# Altium schematic sheet SAME51_PINOUT.SchDoc
size C; SheetNumber: 3; SheetTotal: 5
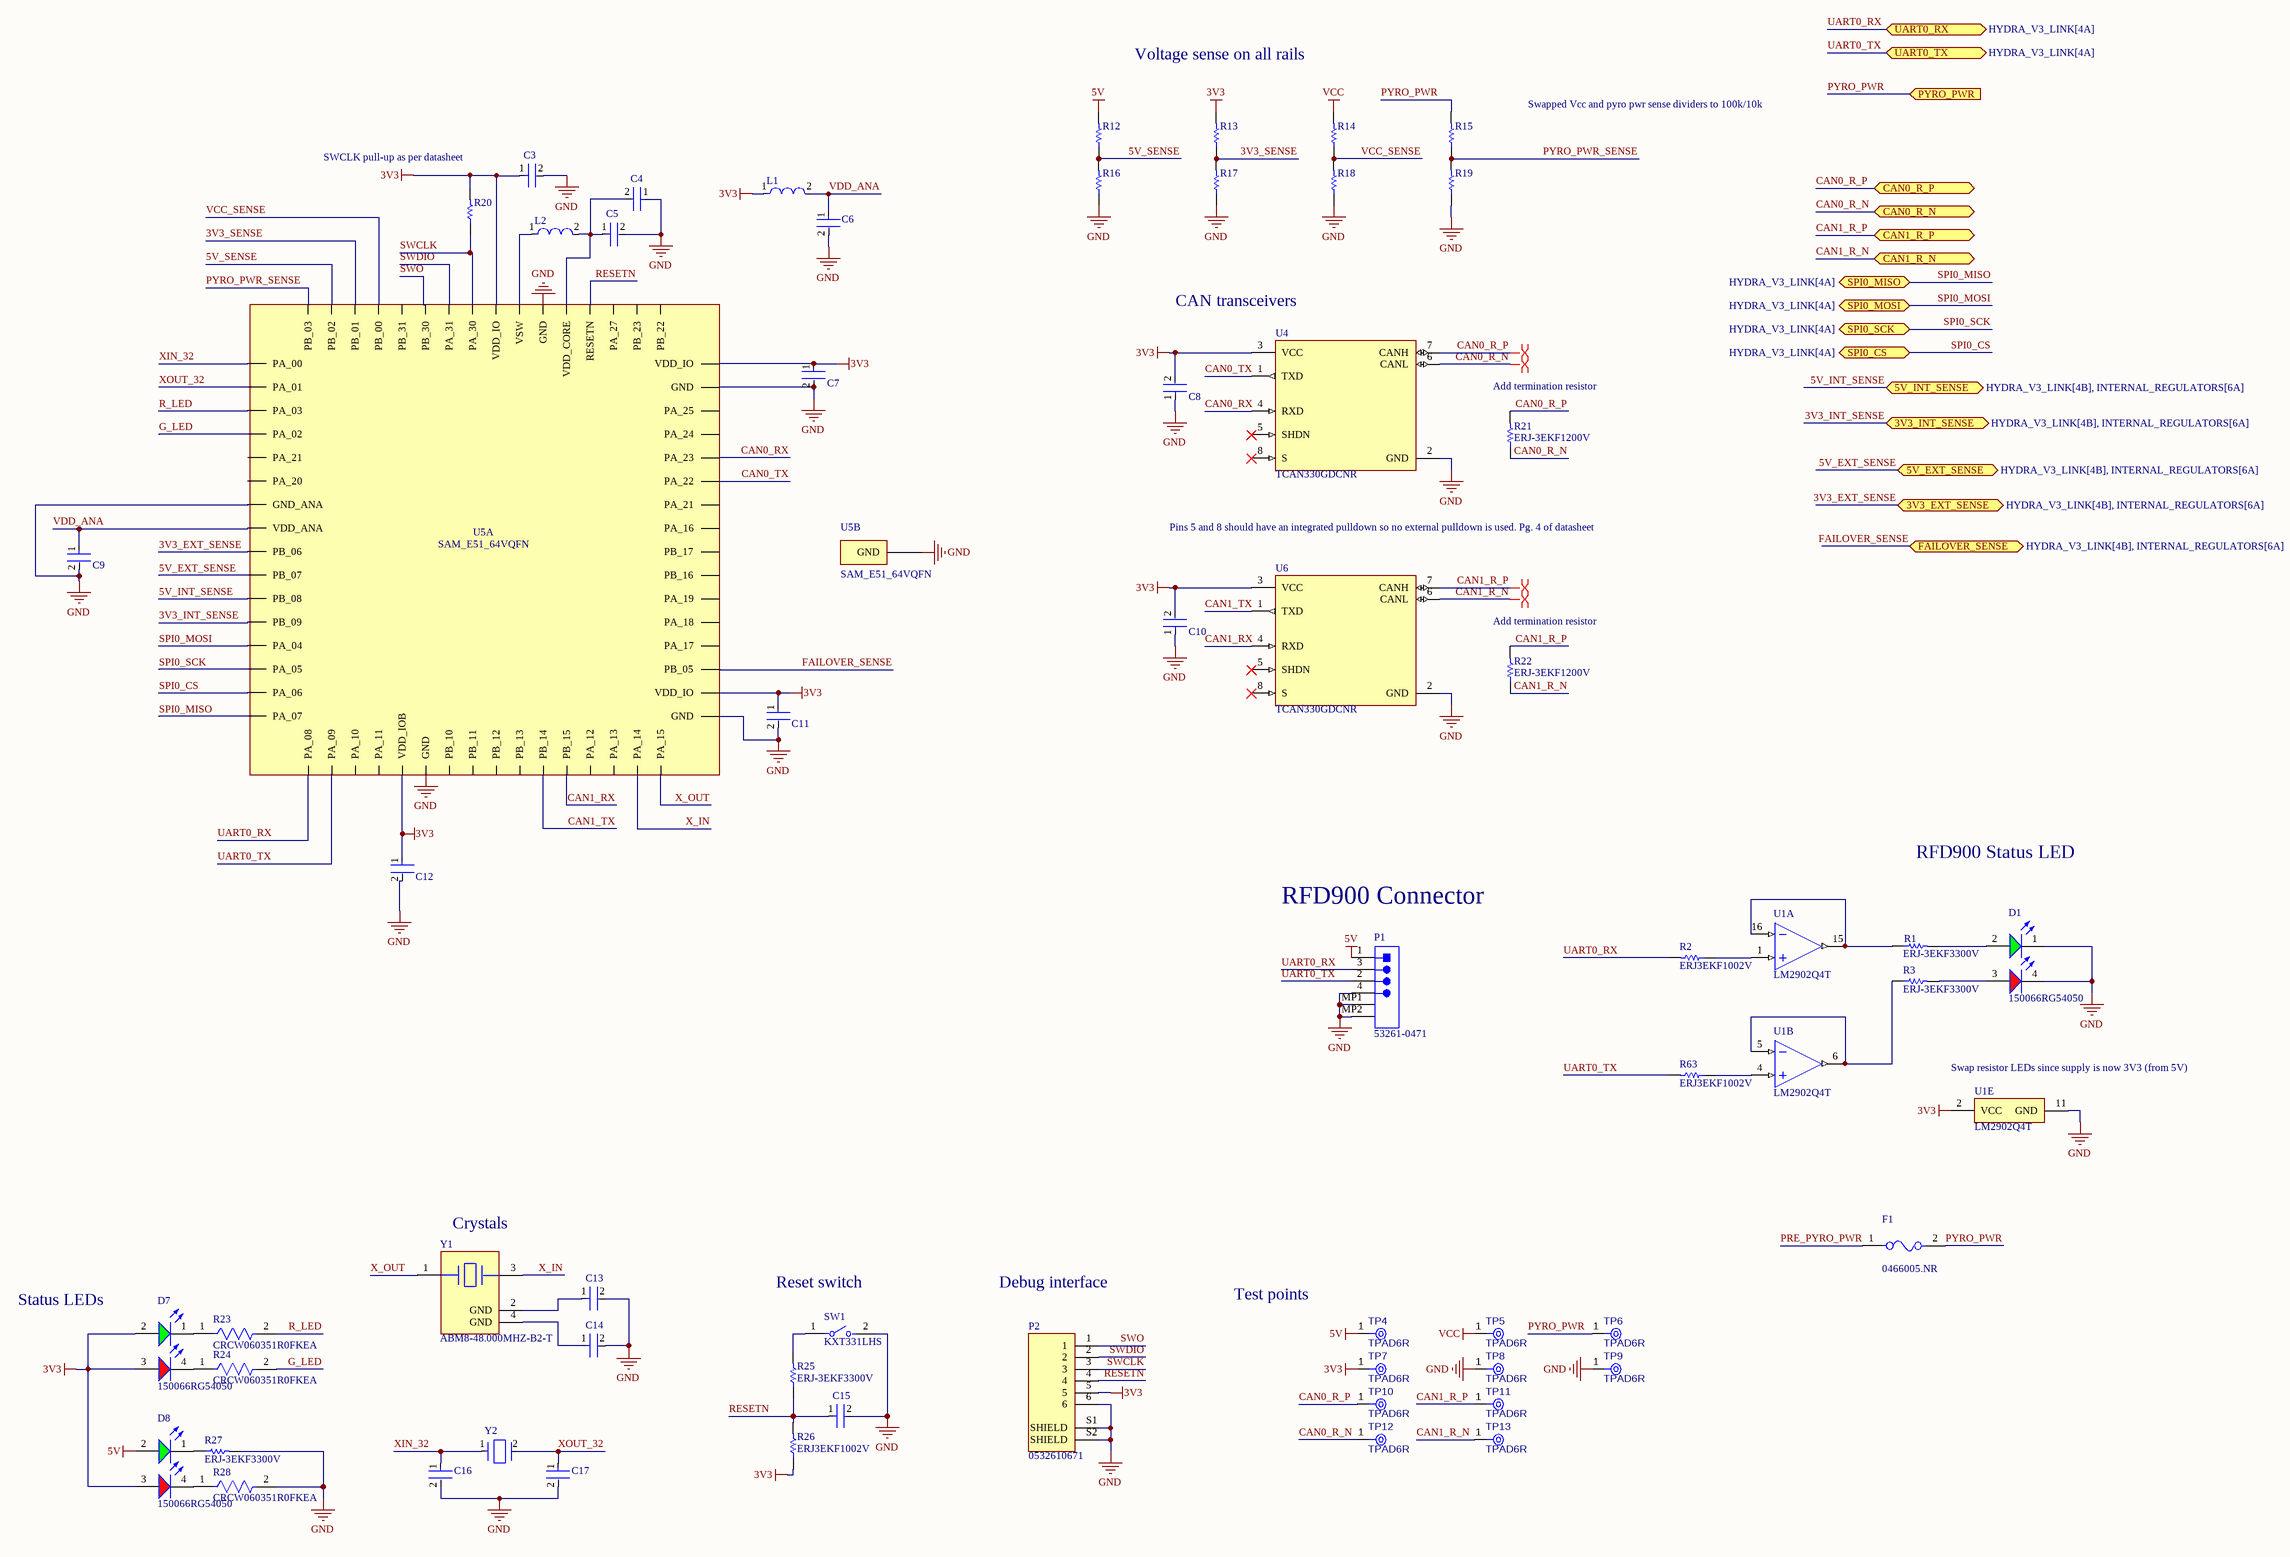
[diagram p0: SAME51_PINOUT.SchDoc]

## Parts
C3  C0402C104K8PACTU  [FP-C0402-BB-MFG]  (value not drawn)
C4  GRM155R60J475ME47D  [FP-GRM155-0_1-IPC_B]  (value not drawn)
C5  C0402C104K8PACTU  [FP-C0402-BB-MFG]  (value not drawn)
C6  C0805C106K8PACTU  [FP-C0805C-DG-MFG]  (value not drawn)
C7  C0402C104K8PACTU  [FP-C0402-BB-MFG]  (value not drawn)
C8  C0402C104K8PACTU  [FP-C0402-BB-MFG]  (value not drawn)
C9  C0402C104K8PACTU  [FP-C0402-BB-MFG]  (value not drawn)
C10  C0402C104K8PACTU  [FP-C0402-BB-MFG]  (value not drawn)
C11  C0402C104K8PACTU  [FP-C0402-BB-MFG]  (value not drawn)
C12  C0402C104K8PACTU  [FP-C0402-BB-MFG]  (value not drawn)
C13  08051A6R8CAT2A  [FP-0805-L_2_01_0_2-W_1_25-MFG]  (value not drawn)
C14  08051A6R8CAT2A  [FP-0805-L_2_01_0_2-W_1_25-MFG]  (value not drawn)
C15  C0402C104K8PACTU  [FP-C0402-BB-MFG]  (value not drawn)
C16  C0805C180J5GACTU  [FP-C0805C-DN-MFG]  (value not drawn)
C17  C0805C180J5GACTU  [FP-C0805C-DN-MFG]  (value not drawn)
D1  150066RG54050  [WL-SBCD_0606]
D7  150066RG54050  [WL-SBCD_0606]
D8  150066RG54050  [WL-SBCD_0606]
F1  0466005.NR  [FP-0466-MFG]
L1  NR6028T100M  [FP-NR6028-MFG]  (value not drawn)
L2  NR6028T100M  [FP-NR6028-MFG]  (value not drawn)
P1  53261-0471  [MOLEX-53261-0471_V]
P2  0532610671  [0532610671-Footprint-1]
R1  ERJ-3EKF3300V  [RESC1608X55X30LL15T15]
R2  ERJ3EKF1002V  [RESC1609X55X30LL15T15]
R3  ERJ-3EKF3300V  [RESC1608X55X30LL15T15]
R12  ERJ3EKF1002V  [RESC1609X55X30LL15T15]  (value not drawn)
R13  ERJ3EKF1002V  [RESC1609X55X30LL15T15]  (value not drawn)
R14  ERJ-3EKF1003V  [RESC1608X55X30ML15T15]  (value not drawn)
R15  ERJ-3EKF1003V  [RESC1608X55X30ML15T15]  (value not drawn)
R16  ERJ3EKF1002V  [RESC1609X55X30LL15T15]  (value not drawn)
R17  ERJ3EKF1002V  [RESC1609X55X30LL15T15]  (value not drawn)
R18  ERJ3EKF1002V  [RESC1609X55X30LL15T15]  (value not drawn)
R19  ERJ3EKF1002V  [RESC1609X55X30LL15T15]  (value not drawn)
R20  ERJ3EKF1002V  [RESC1609X55X30LL15T15]  (value not drawn)
R21  ERJ-3EKF1200V  [RESC1609X55X30ML15T15]
R22  ERJ-3EKF1200V  [RESC1609X55X30ML15T15]
R23  CRCW060351R0FKEA  [FP-CRCW0603-e3-MFG]
R24  CRCW060351R0FKEA  [FP-CRCW0603-e3-MFG]
R25  ERJ-3EKF3300V  [RESC1608X55X30LL15T15]
R26  ERJ3EKF1002V  [RESC1609X55X30LL15T15]
R27  ERJ-3EKF3300V  [RESC1608X55X30LL15T15]
R28  CRCW060351R0FKEA  [FP-CRCW0603-e3-MFG]
R63  ERJ3EKF1002V  [RESC1609X55X30LL15T15]
SW1  KXT331LHS  [FP-KXT331LHS-MFG]
TP4  TPAD6R  [TP06R]  (no BOM)
TP5  TPAD6R  [TP06R]  (no BOM)
TP6  TPAD6R  [TP06R]  (no BOM)
TP7  TPAD6R  [TP06R]  (no BOM)
TP8  TPAD6R  [TP06R]  (no BOM)
TP9  TPAD6R  [TP06R]  (no BOM)
TP10  TPAD6R  [TP06R]  (no BOM)
TP11  TPAD6R  [TP06R]  (no BOM)
TP12  TPAD6R  [TP06R]  (no BOM)
TP13  TPAD6R  [TP06R]  (no BOM)
U1  LM2902Q4T  [LM2902Q4T-Footprint-1]  (parts A,B,E of 5)
U4  TCAN330GDCNR  [FP-DCN0008A-MFG]
U5  SAM_E51_64VQFN  [SAM_E51_64VQFN-Footprint-1]  (parts A,B of 2)
U6  TCAN330GDCNR  [FP-DCN0008A-MFG]
Y1  ABM8-48.000MHZ-B2-T  [FP-ABM8-MFG]
Y2  ECS-.327-12.5-1210-TR  [FP-ECX-1210-MFG]  (value not drawn)

## Ports
3V3_EXT_SENSE (bidir, see HYDRA_V3_LINK[4B], INTERNAL_REGULATORS[6A]), 3V3_INT_SENSE (bidir, see HYDRA_V3_LINK[4B], INTERNAL_REGULATORS[6A]), 5V_EXT_SENSE (bidir, see HYDRA_V3_LINK[4B], INTERNAL_REGULATORS[6A]), 5V_INT_SENSE (bidir, see HYDRA_V3_LINK[4B], INTERNAL_REGULATORS[6A]), CAN0_R_N (bidir, see HYDRA_V3_LINK[4B]), CAN0_R_P (bidir, see HYDRA_V3_LINK[4B]), CAN1_R_N (bidir, see HYDRA_V3_LINK[4B]), CAN1_R_P (bidir, see HYDRA_V3_LINK[4B]), FAILOVER_SENSE (bidir, see HYDRA_V3_LINK[4B], INTERNAL_REGULATORS[6A]), PYRO_PWR (in, see HYDRA_V3_LINK[4A], INTERNAL_REGULATORS[1C]), SPI0_CS (bidir, see HYDRA_V3_LINK[4A]), SPI0_MISO (bidir, see HYDRA_V3_LINK[4A]), SPI0_MOSI (bidir, see HYDRA_V3_LINK[4A]), SPI0_SCK (bidir, see HYDRA_V3_LINK[4A]), UART0_RX (bidir, see HYDRA_V3_LINK[4A]), UART0_TX (bidir, see HYDRA_V3_LINK[4A])

## Nets
3V3: C3.1 C7.1 C8.2 C10.2 C11.1 C12.1 D7.2(A) D7.3(A) D8.3(A) L1.1 P2.5 R13.2 R20.2 R26.1 TP7.1(TP) U1.2(VCC) U4.3(VCC) U5.21(VDD_IOB) U5.34(VDD_IO) U5.48(VDD_IO) U5.56(VDD_IO) U6.3(VCC)
5V: D8.2(A) P1.1 R12.2 TP4.1(TP)
GND: C3.2 C4.1 C5.2 C6.2 C7.2 C8.1 C9.2 C10.1 C11.2 C12.2 C13.2 C14.2 C15.2 C16.2 C17.2 D1.1(K) D1.4(K) P1.4 P1.MP1 P1.MP2 P2.6 P2.S1(SHIELD) P2.S2(SHIELD) R16.1 R17.1 R18.1 R19.1 R27.2 R28.2 SW1.2 TP8.1(TP) TP9.1(TP) U1.11(GND) U4.2(GND) U5.7(GND_ANA) U5.22(GND) U5.33(GND) U5.47(GND) U5.54(GND) U5.65(GND) U6.2(GND)
VCC: R14.2 TP5.1(TP)
3V3_EXT_SENSE: U5.9(PB_06) ; port 3V3_EXT_SENSE
3V3_INT_SENSE: U5.12(PB_09) ; port 3V3_INT_SENSE
3V3_SENSE: R13.1 R17.2 U5.62(PB_01)
5V_EXT_SENSE: U5.10(PB_07) ; port 5V_EXT_SENSE
5V_INT_SENSE: U5.11(PB_08) ; port 5V_INT_SENSE
5V_SENSE: R12.1 R16.2 U5.63(PB_02)
CAN0_R_N: R21.1 TP12.1(TP) U4.6(CANL) ; port CAN0_R_N
CAN0_R_P: R21.2 TP10.1(TP) U4.7(CANH) ; port CAN0_R_P
CAN0_RX: U4.4(RXD) U5.44(PA_23)
CAN0_TX: U4.1(TXD) U5.43(PA_22)
CAN1_R_N: R22.1 TP13.1(TP) U6.6(CANL) ; port CAN1_R_N
CAN1_R_P: R22.2 TP11.1(TP) U6.7(CANH) ; port CAN1_R_P
CAN1_RX: U5.28(PB_15) U6.4(RXD)
CAN1_TX: U5.27(PB_14) U6.1(TXD)
FAILOVER_SENSE: U5.6(PB_05) ; port FAILOVER_SENSE
G_LED: R24.2 U5.3(PA_02)
PRE_PYRO_PWR: F1.1
PYRO_PWR: F1.2 R15.2 TP6.1(TP) ; port PYRO_PWR
PYRO_PWR_SENSE: R15.1 R19.2 U5.64(PB_03)
R_LED: R23.2 U5.4(PA_03)
RESETN: C15.1 P2.4 R25.1 R26.2 U5.52(RESETN)
SPI0_CS: U5.15(PA_06) ; port SPI0_CS
SPI0_MISO: U5.16(PA_07) ; port SPI0_MISO
SPI0_MOSI: U5.13(PA_04) ; port SPI0_MOSI
SPI0_SCK: U5.14(PA_05) ; port SPI0_SCK
SWCLK: P2.3 R20.1 U5.57(PA_30)
SWDIO: P2.2 U5.58(PA_31)
SWO: P2.1 U5.59(PB_30)
UART0_RX: P1.3 R2.2 U5.17(PA_08) ; port UART0_RX
UART0_TX: P1.2 R63.2 U5.18(PA_09) ; port UART0_TX
VCC_SENSE: R14.1 R18.2 U5.61(PB_00)
VDD_ANA: C6.1 C9.1 L1.2 U5.8(VDD_ANA)
X_IN: U5.31(PA_14) Y1.3
X_OUT: U5.32(PA_15) Y1.1
XIN_32: C16.1 U5.1(PA_00) Y2.1(In/Out)
XOUT_32: C17.1 U5.2(PA_01) Y2.2(Out/In)
NetC4_2: C4.2 C5.1 L2.2 U5.53(VDD_CORE)
NetC13_1: C13.1 Y1.2(GND)
NetC14_1: C14.1 Y1.4(GND)
NetD1_2: D1.2(A) R1.2
NetD1_3: D1.3(A) R3.2
NetD7_1: D7.1(K) R23.1
NetD7_4: D7.4(K) R24.1
NetD8_1: D8.1(K) R27.1
NetD8_4: D8.4(K) R28.1
NetL2_1: L2.1 U5.55(VSW)
NetR1_1: R1.1 U1.15(1OUT) U1.16(1IN-)
NetR2_1: R2.1 U1.1(1IN+)
NetR3_1: R3.1 U1.5(2IN-) U1.6(2OUT)
NetR25_2: R25.2 SW1.1
NetR63_1: R63.1 U1.4(2IN+)

Not connected (* = marked no-connect by the designer): U4 5(SHDN)* 8(S)*; U5 19(PA_10) 20(PA_11) 23(PB_10) 24(PB_11) 25(PB_12) 26(PB_13) 29(PA_12) 30(PA_13) 35(PA_16) 36(PA_17) 37(PA_18) 38(PA_19) 39(PB_16) 40(PB_17) 41(PA_20) 42(PA_21) 45(PA_24) 46(PA_25) 49(PB_22) 50(PB_23) 51(PA_27) 60(PB_31); U6 5(SHDN)* 8(S)*

## Layout directives
differential pair: CAN0_R_N, CAN0_R_P, CAN1_R_N, CAN1_R_P

## Notes on the sheet
- Voltage sense on all rails
- Swapped Vcc and pyro pwr sense dividers to 100k/10k
- SWCLK pull-up as per datasheet
- (near U4) CAN transceivers
- (near R21) Add termination resistor
- Pins 5 and 8 should have an integrated pulldown so no external pulldown is used. Pg. 4 of datasheet
- (near R22) Add termination resistor
- RFD900 Status LED
- RFD900 Connector
- (near U1) Swap resistor LEDs since supply is now 3V3 (from 5V)
- (near Y1) Crystals
- (near SW1) Reset switch
- Debug interface
- Status LEDs
- Test points

## Library data of the parts
C3 C5 C7-C12 C15 = CMP-2008-02046-2: CAP CER 0.1UF 10V X5R 0402; Manufacturer: Kemet; Material: Ceramic; Capacitance: 0.10 μF; Temperature Coefficient: 15%; Tolerance: 0.1; Value: 0.10 μF; Package: C0402-BB; Temperature: -55°C to +125°C; ComponentLink2Description: Datasheet; Temperature Characteristic: X5R; Device Class L1: Passive Components; Height: 0.55mm; Lead Free: Yes; ComponentLink2URL: https://content.kemet.com/datasheets/KEM_C1002_X7R_SMD.pdf; Device Class L2: Capacitors; Temperature Range Low: -55°C; Temperature Range High: +125°C; RoHS: TRUE; Octopart: https://octopart.com/c0402c104k8pactu-kemet-140039; Automotive: No; Mouser Description: Capacitor 100 nF 10 VDC 0402; Category: Cap; Voltage Rating: 10 V; Digikey Description: CAP CER 0.1UF 10V X5R 0402; Ipc Land Pattern Name: CAPC10050X50; Device Class L3: Ceramic Capacitors; Manufacturer Part Number: C0402C104K8PACTU
C4 = CMP-2008-04549-2: Chip Multilayer Ceramic Capacitors for General Purpose, 0402, 4.7uF, X5R, 15%, 20%, 6.3V; Height: 0.5mm; Weight: 0.000212oz; Length: 1mm; Case Code (Metric): 1005; Packaging: Tape and Reel; Termination: SMD/SMT; Dielectric: X5R; Depth: 0.5mm; Case Code (Imperial): 0402; Min Operating Temperature: -55°C; Case/Package: 0402; Voltage: 6.3V; Width: 0.02inch; Capacitance: 4.7uF; Lead Free: Lead Free; Thickness: 0.022inch; Contact Plating: Tin; REACH SVHC: No SVHC; Package Quantity: 10000; Tolerance: 20%; Voltage Rating (DC): 6.3V; Voltage Rating: 6.3V; Mount: Surface Mount; Max Operating Temperature: 85°C
C6 = CMP-2007-03243-2: CAP CER 10UF 10V X5R 0805; Manufacturer: Kemet; 3DS Part Number: 220-00001; Tolerance: 10%; Temperature Coefficient: 15%; Material: Ceramic; Device Class L2: Capacitors; Device Class L1: Passive Components; ComponentLink2URL: https://content.kemet.com/datasheets/KEM_C1006_X5R_SMD.pdf; Height: 1.4mm; Lead Free: Yes; Manufacturer Part Number: C0805C106K8PACTU; Digikey Description: CAP CER 10UF 10V X5R 0805; Octopart: https://octopart.com/c0805c106k8pactu-kemet-98697; Capacitance: 10uF; Value: 10uF; Temperature Range Low: -55°C; Temperature: -55°C to +85°C; Automotive: No; Mouser Description: CAP CER 10UF 10V X5R 0805; Ipc Land Pattern Name: CAPC200125X125; Temperature Range High: +85°C; Voltage: 10V; RoHS: TRUE; Device Class L3: Ceramic Capacitors; ComponentLink2Description: Datasheet; Voltage Rating: 10V; Package: C0805C-DG; Temperature Characteristic: X5R; Category: Cap
C13 C14 = CMP-1036-00709-3: General Purpose Ceramic Capacitor, 0805, 6.8pF, 0.25pF, C0G, 30ppm/°C, 100V; Dissipation Factor: 10%; Insulation Resistance: 100GR; Tolerance: 5%; Max Operating Temperature: 125°C; RoHS Compliant: Yes; Capacitance: 6.8pF; Termination: SMD/SMT; Number of Pins: 2; Packaging: Tape and Reel; Mount: Surface Mount; Case Code (Metric): 2012; Case Code (Imperial): 0805; Height: 0.71mm; Min Operating Temperature: -55°C; Width: 0.049inch; Temperature Coefficient: 0ppm/°C; Length: 2.01mm; Dielectric: C0G; Series: -; Voltage Rating (DC): 100V; Dielectric Material: Ceramic; Depth: 1.25mm; Contact Plating: Tin; Voltage Rating: 100V; Thickness: 0.037inch; Case/Package: 0805; Lead Free: Lead Free; Radiation Hardening: No; Voltage: 100V; Construction: Flat; Package Quantity: 1; REACH SVHC: No SVHC
C16 C17 = CMP-2007-00302-2: CAP CER 18PF 50V C0G/NP0 0805; Manufacturer: KEMET; Temperature Characteristic: C0G; Tolerance: 0.05; Material: Ceramic; Temperature Coefficient: 30ppm/°C; Device Class L2: Capacitors; Capacitance: 18 pF; Temperature: -55°C to +125°C; Value: 18 pF; Package: C0805C-DN; Mouser Description: Cap Ceramic 18pF 50V C0G 5% SMD 0805 125C Paper T/R; Height: 0.88mm; ComponentLink2URL: https://content.kemet.com/datasheets/KEM_C1003_C0G_SMD.pdf; RoHS: TRUE; Octopart: https://octopart.com/c0805c180j5gactu-kemet-144810; ComponentLink2Description: Datasheet; Temperature Range High: +125°C; Digikey Description: CAP CER 18PF 50V C0G/NP0 0805; Device Class L1: Passive Components; Category: Cap; Automotive: No; Device Class L3: Ceramic Capacitors; Voltage Rating: 50 V; Temperature Range Low: -55°C; Ipc Land Pattern Name: CAPC200125X78; Lead Free: Yes; Manufacturer Part Number: C0805C180J5GACTU
D1 D7 D8 = CMP-004-00034-2: Led, Red/Grn, 180Mcd/230Mcd, 624Nm/525Nm Rohs Compliant: Yes
F1 = CMP-08605-000032-1: FUSE BOARD MNT 5A 32VAC/VDC 1206; Manufacturer: Littelfuse Inc; Value: 0.011Ω; Max Fuse Ac Voltage: 32V; Fuse I2T: 2.5A2Sec; Fuse Interrupt Ac Current: 50A; Fuse Blow Speed: Fast; Fuse Voltage Drop: 73.75mV; Category: Fuse; Temperature: -55°C to +90°C; Lead Free: Yes; Temperature Range High: +90°C; RoHS: TRUE; Device Class L2: Fuses; ComponentLink2URL: https://www.littelfuse.com/~/media/electronics/datasheets/fuses/littelfuse_fuse_466_datasheet.pdf.pdf; Fuse Current: 5A; Octopart: https://octopart.com/0466005.nr-littelfuse-143206; Automotive: No; Max Fuse Dc Voltage: 32V; Temperature Range Low: -55°C; Device Class L3: unset; ComponentLink2Description: Datasheet; Manufacturer Part Number: 0466005.NR; Fuse Interrupt Dc Current: 50A; Resistance: 0.011Ω; Package: 0466; Device Class L1: Circuit Protection; Mouser Description: Surface Mount Fuses 32V 5A VFA Slimline; Height: 0.66mm; Voltage Rating: 32V; Digikey Description: FUSE BOARD MNT 5A 32VAC/VDC 1206
L1 L2 = CMP-14484-000406-1: SMD Power Inductors 10uH ±20% 1.9A 84.5mΩ; Core Material: Ferrite; Self Resonant Frequency: 20MHz; Test Frequency: 100kHz; DC Resistance (DCR): 84.5mR; Shielding: Shielded; Current Rating: 1.9A; Package Quantity: 2000; Tolerance: 20%; Saturation Current: 1.9A; Max Operating Temperature: 120°C; Case/Package: 2424; Number of Pins: 2; Lead Free: Lead Free; Series: NR; Inductance Tolerance: 20%; RMS Current (Irms): 1.9A; Max DC Current: 1.9A; Resistor Type: Wirewound; Min Operating Temperature: -25°C; Width: 6mm; Height - Seated (Max): 0.11inch; RoHS Compliant: Yes; Mount: Surface Mount; Packaging: Tape and Reel; Inductance: 10uH; Length: 0.236inch; Halogen Free: Halogen Free; Height: 2.8mm; Termination: SMD/SMT
P1 = CMP-2000-05238-1: Male Header, Pitch 1.25 mm, 1 x 4 Position, Height 3.4 mm, -40 to 85 degC, RoHS, Tape and Reel; Current Rating: 1A; Brand: Molex; Number of Positions / Contacts: 4; Pitch: 1.25mm; Voltage Rating: 125V; Mounting Angle: Right; Manufacturer URL: http://www.molex.com/; Factory Pack Quantity: 1000; Housing Material: Thermoplastic; Datasheet URL: http://www.molex.com/pdm_docs/sd/532610471_sd.pdf; Tradename: PicoBlade; Product Type: Headers; Contact Plating: Tin; Contact Material: PhosphorBronze; Package Description: 1.25mm Pitch PicoBlade(TM) Header, Surface Mount, Right Angle, Lead-Free, 4 Circuits; Mounting Style: SMD/SMT; Manufacturer: Molex; Series: 53261; Packaging: Reel; Number of Rows: 1; RoHS: Details; Number of Positions: 4; Product Category: Headers&WireHousings; Datasheet Version: Rev. G, 01/2012; Type: Shrouded; Termination Style: SMD
P2 = CMP-002-00079-1: Conn Shrouded Header (4 Sides) HDR 6 POS 1.25mm Solder RA Side Entry SMD PicoBlade™ T/R
R1 R3 R25 R27 = CMP-2000-00435-2: Chip Resistor, 330 Ohm, +/- 1%, 0.1 W, -55 to 155 degC, 0603 (1608 Metric), RoHS, Tape and Reel; Gender: Male; Mating Cycles: 10000; Current Rating: 500 mA; Voltage Rating: 10 V; REACH SVHC: No SVHC; PackageDescription: 2-Pin Surface Mount Device, Body 1.6 x 0.85 mm; Contact Finish: Gold; Pins: 8; ComponentLink1Description: Manufacturer URL; Packaging: Tape and Reel; Max Operating Temperature: 85 degC; Contact Material: Copper; Height: 1.45 mm; Width: 1.45 mm; DatasheetVersion: Apr-15; Package Quantity: 1500; Contact Plating: Gold; PackageReference: 0603; Mount: Surface Mount; Lead Pitch: 1.1 mm; Min Operating Temperature: -25 degC; ComponentLink1URL: http://www.panasonic.com/; ComponentLink2URL: http://industrial.panasonic.com/cdbs/www-data/pdf/RDA0000/AOA0000C86.pdf; Length: 13.7 mm; ComponentLink2Description: Datasheet; RoHSCompliant: true
R2 R12 R13 R16-R20 R26 R63 = CMP-1012-00623-3: Chip Resistor, 10 KOhm, +/- 1%, 0.1 W, -55 to 155 degC, 0603 (1608 Metric), RoHS, Tape and Reel; Manufacturer: Panasonic; Voltage Rating: 75V; Case\/Package: 0603; Power Rating: 100mW; Resistance: 10KOhm; Temperature Coefficient: 100ppm\/degreesC; Number of Pins: 2; Package Reference: 603; Depth: 0.8mm; Mount: SurfaceMount; Package Description: 2-Pin Surface Mount Device, Body 1.6 x 0.85 mm; Datasheet Version: 02/2017; Length: 1.6mm; Lead Free: LeadFree; Height: 0.45mm; Number of Terminations: 2; Max Power Dissipation: 100mW; Min Operating Temperature: -55degC; Datasheet URL: https://industrial.panasonic.com/cdbs/www-data/pdf/RDA0000/AOA0000C304.pdf; Termination: SMD/SMT; Case Code (Metric): 1608; Case Code (Imperial): 0603; Tolerance: 1%; Max Operating Temperature: 155degC; RoHSCompliant: true; Voltage Rating (DC): 75V; Radiation Hardening: No; Packaging: TapeandReel; Composition: ThickFilm; Mounting Technology: SurfaceMount; Manufacturer URL: http://www.panasonic.com/; Width: 0.031inch; REACH SVHC: NoSVHC; Contact Plating: Tin; Military Standard: Not; Package Quantity: 1
R14 R15 = CMP-2000-00182-1: Manufacturer: Panasonic; Part Number: ERJ-3EKF1003V
R21 R22 = CMP-2000-00213-2: Chip Resistor, 120 Ohm, +/- 1%, 0.1 W, -55 to 155 degC, 0603 (1608 Metric), RoHS, Tape and Reel; Manufacturer: Panasonic; Power Rating: 100mW; Voltage Rating (DC): 75V; Resistance: 120Ohm; Temperature Coefficient: 100ppm/degreesC; Number of Terminations: 2; Military Standard: Not; Tolerance: 1%; Min Operating Temperature: -55degC; Packaging: TapeandReel; Lead Free: LeadFree; Max Operating Temperature: 155degC; Manufacturer URL: http://www.panasonic.com/; Case Code (Imperial): 0603; REACH SVHC: NoSVHC; Width: 0.031inch; Datasheet URL: https://industrial.panasonic.com/cdbs/www-data/pdf/RDA0000/AOA0000C283.pdf; RoHSCompliant: true; Max Power Dissipation: 100mW; Termination: SMD/SMT; Package Reference: 0603; Height: 0.022inch; Depth: 0.8mm; Package Description: 2-Pin Surface Mount Device, Body 1.6 x 0.85 mm; Contact Plating: Tin; Length: 1.6mm; Package URL: http://www.st.com/st-web-ui/static/active/en/resource/technical/document/datasheet/CD00001320.pdf; Radiation Hardening: No; Package Quantity: 1; Number of Pins: 2; Datasheet Version: 42095.0; Voltage Rating: 75V; Composition: ThickFilm; Case/Package: 0603; Mount: SurfaceMount; Case Code (Metric): 1608
R23 R24 R28 = CMP-2000-03446-2: RES Thick Film, 51Ω, 1%, 0.1W, 100ppm/°C, 0603; Power Rating: 100mW; Voltage Rating: 75V; Resistance: 51R; Military Standard: Not; Case Code (Imperial): 0603; Max Operating Temperature: 155°C; Temperature Coefficient: 100ppm/°C; Lead Free: Lead Free; Weight: 7.1E-05oz; Number of Pins: 2; Package Quantity: 10; Case/Package: 0603; Termination: SMD/SMT; Min Operating Temperature: -55°C; Tolerance: 1%; Contact Plating: Tin; Height: 0.45mm; Working Voltage: 75V; Radiation Hardening: No; Packaging: Tape and Reel; Composition: Thick Film; Max Power Dissipation: 100mW; Width: 0.85mm; Depth: 0.85mm; Length: 1.55mm; Case Code (Metric): 1608; Voltage Rating (DC): 75V; Number of Terminations: 2; Features: Automotive AEC-Q200
SW1 = CMP-10040-000029-1: SWITCH TACTILE SPST-NO 0.02A 15V; Operating Force: 240gf; Switch Travel: 0.13mm; Illumination Type: Non-Illuminated; Throw Configuration: SPST; Number of Ports: 1; Current Rating: 5A; Mechanical Life: 500000Cycles; Switch Function: Off-Mom; Connector Type: USB; Actuator Type: Standard; Gender: Receptacle; Number of Contacts: 24; Contact Plating: Gold; Insulation Color: Black; Min Operating Temperature: -40°C; Packaging: Tape and Reel; Flammability Rating: UL94 V-0; Max Operating Temperature: 85°C; Termination: Solder; Mount: Surface Mount
TP4-TP13 = CMP-00028-00002-2: 0.6mm round; Pins: 1
U1 = CMP-014-00004-1: LM2902 Series 30 V 1.3 MHz Low-Power Quad Operational Amplifier - QFN-16 (3x3)
U4 U6 = CMP-04872-000178-1: IC TRANSCEIVER 1/1 SOT23-8; Data Rate: 1Mbps; Packaging: Tape and Reel; Min Operating Temperature: -40°C; Max Operating Temperature: 125°C; RoHS Compliant: Yes; Lead Free: Lead Free; Case/Package: SOT-23-8; Mount: Surface Mount
U5 = CMP-016-00010-6: Rudimentary symbol and footprint for the SAM E51 microcontroller
Y1 = CMP-27762-011708-1: Crystal 48MHz ±20ppm 18pF SMD-4 3.2mm x 2.5mm; Series Resistance: 35R; Frequency Stability: 50ppm; Package Quantity: 1000; Packaging: Tape and Reel; Mount: Surface Mount; Length: 3.2mm; Load Capacitance: 18pF; Max Operating Temperature: 70°C; Operating Frequency: 48 MHz; RoHS Compliant: Yes; Series: ABM8; Frequency Tolerance: 20ppm; Lead Free: Lead Free; Min Operating Temperature: -20°C; Case/Package: CSMD; Number of Pins: 4; Height: 0.031inch; ESR (Equivalent Series Resistance): 35R; Frequency: 48MHz; Radiation Hardening: No; Width: 0.098inch; Tolerance: 20ppm; Termination: SMD/SMT; Depth: 2.5mm; Resistor Type: Ceramic; REACH SVHC: No SVHC
Y2 = CMP-40224-000006-1: CRYSTAL 32.7680KHZ 12.5PF SMD; Manufacturer: ECS International; Frequency: 32.768kHz; Esr: 90kΩ; Tolerance: 20ppm; Device Class L1: Passive Components; Load Capacitance: 12.5pF; Temperature: -40°C to +85°C; ComponentLink2URL: https://ecsxtal.com/store/pdf/ECX-1210.pdf; Series: ECX-1210; Octopart: https://octopart.com/ecs-.327-12.5-1210-tr-ecs+international-81221340; ComponentLink2Description: Datasheet; Temperature Range Low: -40°C; Digikey Description: CRYSTAL 32.7680KHZ 12.5PF SMD; Lead Free: Yes; RoHS: TRUE; Device Class L3: Crystals; Automotive: No; Category: Crys; Height: 0.5mm; Manufacturer Part Number: ECS-.327-12.5-1210-TR; Temperature Range High: +85°C; Device Class L2: Crystals / Oscillators; Package: ECX-1210